# Altium project PMSM_Invertor.PrjPcb
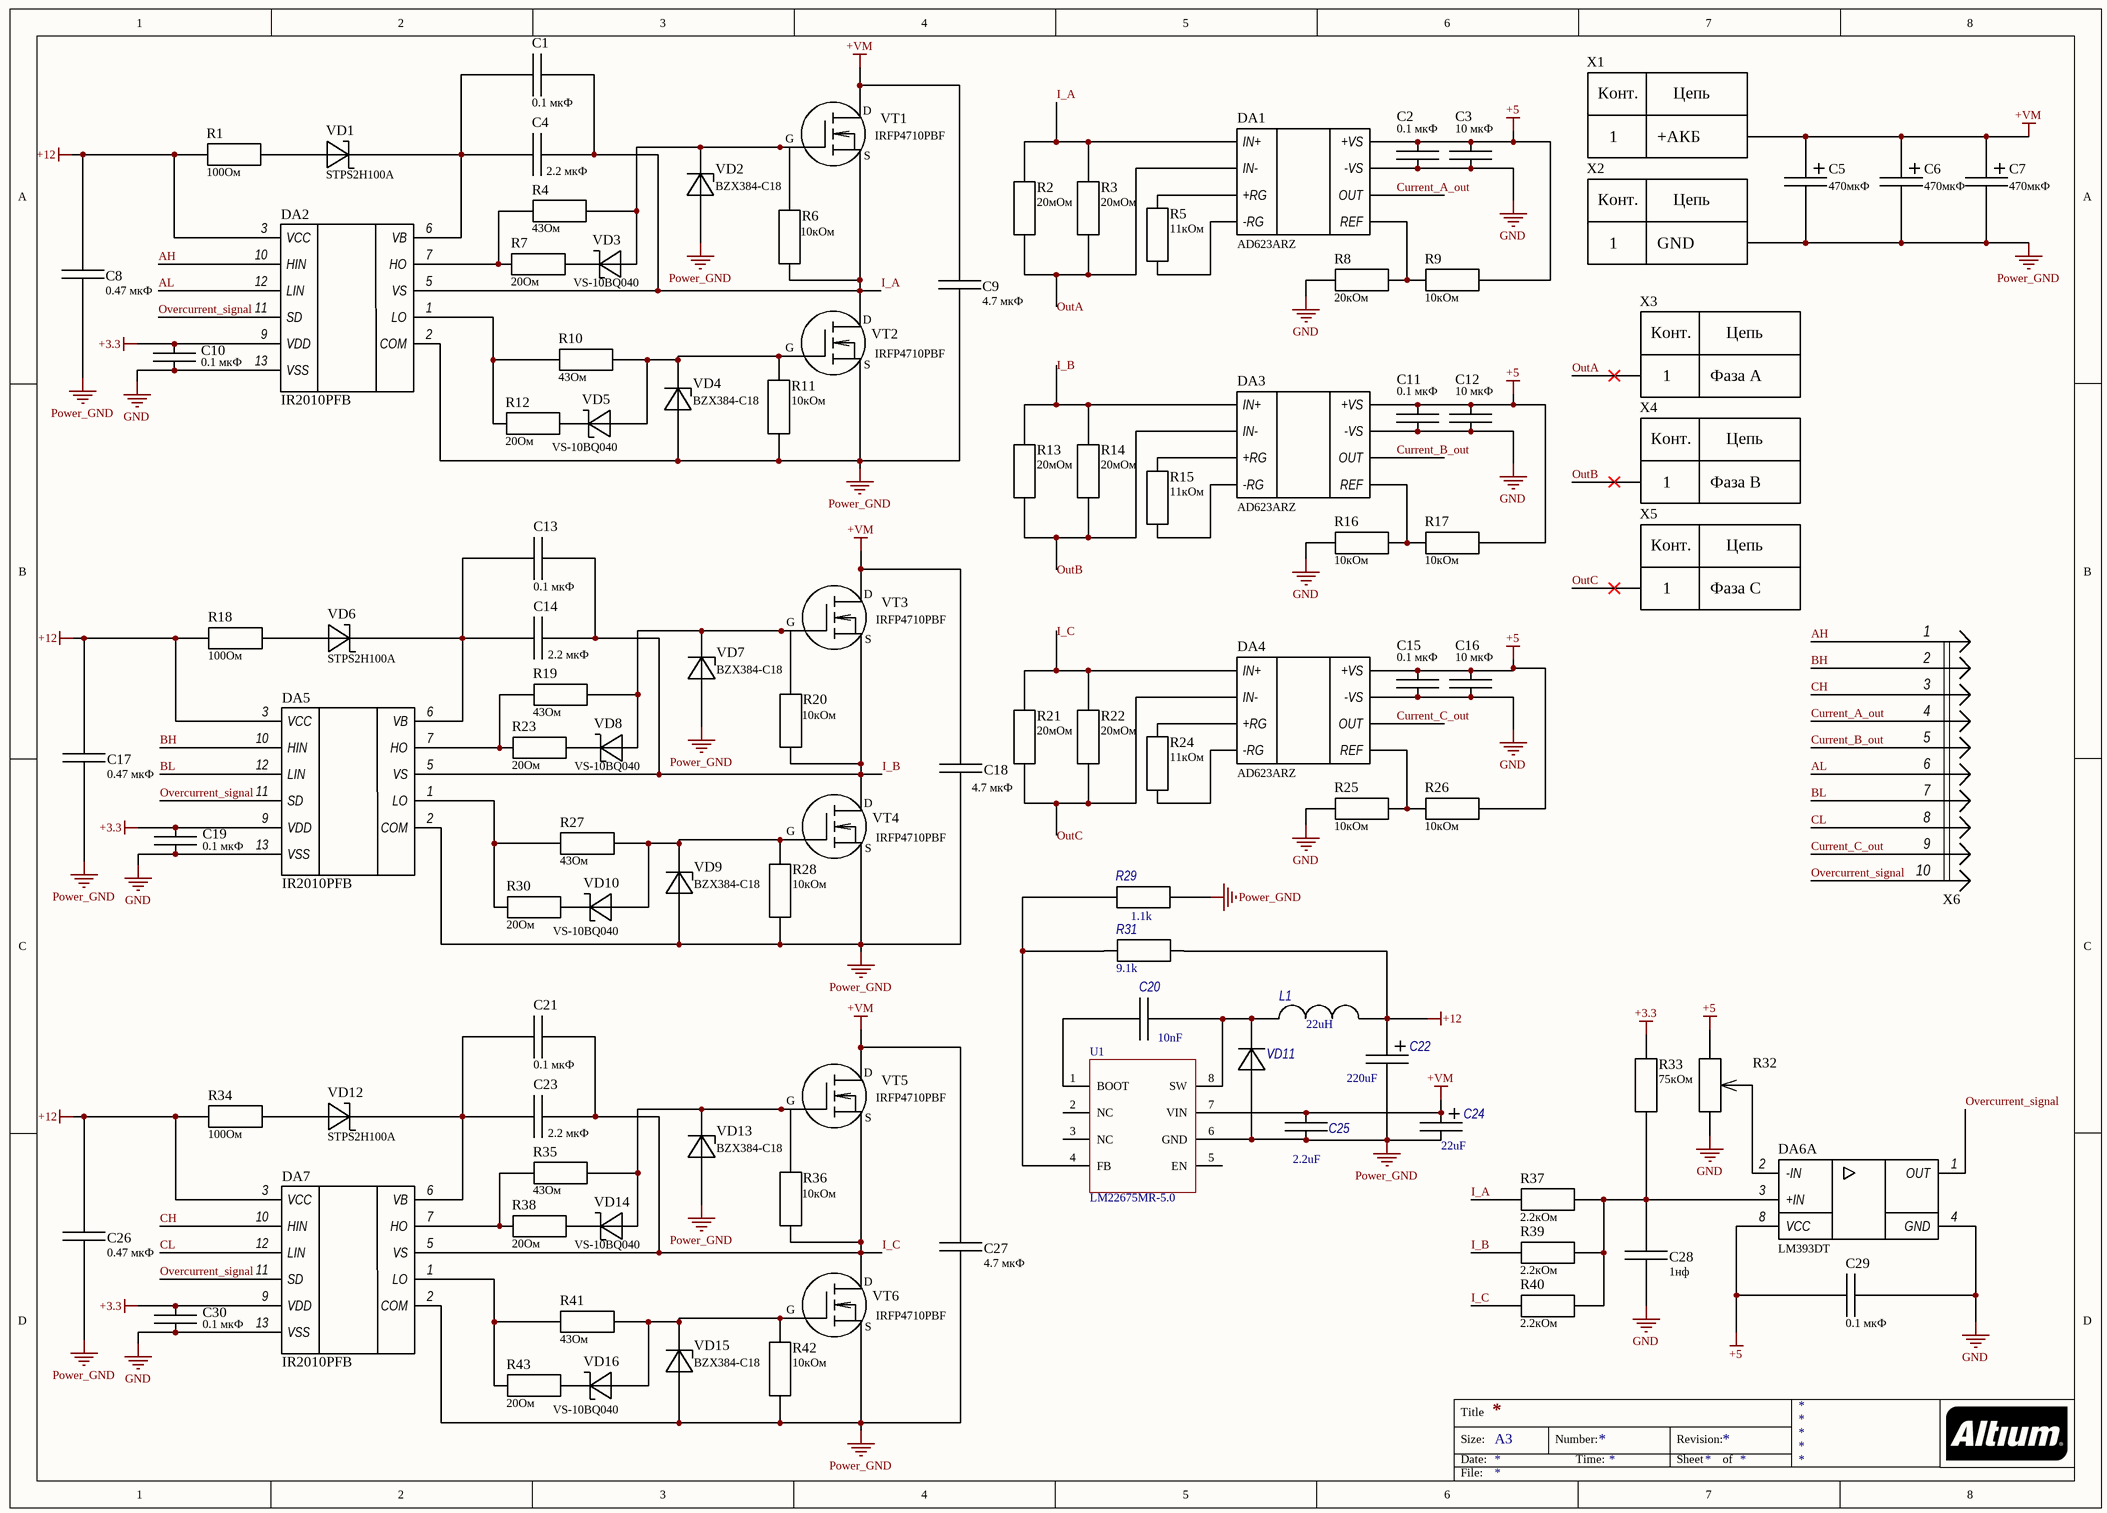
[diagram p0: bridge.SchDoc]
2 sheets, 110 parts. Net scope: global (net labels, ports and power ports of the same name join across sheets).
Board files: InvertorPCB.PcbDoc, Invertor_1.PcbDoc
Sheets:
  bridge.SchDoc
  power_elements.SchDoc

## Sheet bridge.SchDoc
size A3

### Parts
C1  value 0.1 мкФ  [0805]  (hidden comment: Capacitor)
C2  value 0.1 мкФ  [C0603C]  (hidden comment: Capacitor)
C3  value 10 мкФ  [0805]  (hidden comment: Capacitor)
C4  value 2.2 мкФ  [1812С]  (hidden comment: Capacitor)
C5  value 470мкФ  [CAP-10]  (hidden comment: Сapacitor pol)
C6  value 470мкФ  [CAP-10]  (hidden comment: Сapacitor pol)
C7  value 470мкФ  [CAP-10]  (hidden comment: Сapacitor pol)
C8  value 0.47 мкФ  [0805]  (hidden comment: Capacitor)
C9  value 4.7 мкФ  [2220С]  (hidden comment: Capacitor)
C10  value 0.1 мкФ  [C0603C]  (hidden comment: Capacitor)
C11  value 0.1 мкФ  [C0603C]  (hidden comment: Capacitor)
C12  value 10 мкФ  [0805]  (hidden comment: Capacitor)
C13  value 0.1 мкФ  [0805]  (hidden comment: Capacitor)
C14  value 2.2 мкФ  [1812С]  (hidden comment: Capacitor)
C15  value 0.1 мкФ  [C0603C]  (hidden comment: Capacitor)
C16  value 10 мкФ  [0805]  (hidden comment: Capacitor)
C17  value 0.47 мкФ  [0805]  (hidden comment: Capacitor)
C18  value 4.7 мкФ  [2220С]  (hidden comment: Capacitor)
C19  value 0.1 мкФ  [C0603C]  (hidden comment: Capacitor)
C20  value 10nF  [C0805C]
C21  value 0.1 мкФ  [0805]  (hidden comment: Capacitor)
C22  value 220uF  [CAP-8x12]
C23  value 2.2 мкФ  [1812С]  (hidden comment: Capacitor)
C24  value 22uF  [CAP-К50-35]
C25  value 2.2uF  [C1812C]
C26  value 0.47 мкФ  [0805]  (hidden comment: Capacitor)
C27  value 4.7 мкФ  [2220С]  (hidden comment: Capacitor)
C28  value 1нф  [C1206C]  (hidden comment: Capacitor)
C29  value 0.1 мкФ  [C0603C]  (hidden comment: Capacitor)
C30  value 0.1 мкФ  [C0603C]  (hidden comment: Capacitor)
DA1  AD623ARZ  [SO8]
DA2  IR2010PFB  [DIP14]
DA3  AD623ARZ  [SO8]
DA4  AD623ARZ  [SO8]
DA5  IR2010PFB  [DIP14]
DA6  LM393DT  [SO8]  (part A of 2)
DA7  IR2010PFB  [DIP14]
L1  value 22uH  [IND0488-G-E]
R1  value 100Ом  [2512R]  (hidden comment: Resistor)
R2  value 20мОм  [2816R]  (hidden comment: Resistor)
R3  value 20мОм  [2816R]  (hidden comment: Resistor)
R4  value 43Ом  [2512R]  (hidden comment: Resistor)
R5  value 11кОм  [0402R]  (hidden comment: Resistor)
R6  value 10кОм  [0402R]  (hidden comment: Resistor)
R7  value 20Ом  [2512R]  (hidden comment: Resistor)
R8  value 20кОм  [0402R]  (hidden comment: Resistor)
R9  value 10кОм  [0402R]  (hidden comment: Resistor)
R10  value 43Ом  [2512R]  (hidden comment: Resistor)
R11  value 10кОм  [0402R]  (hidden comment: Resistor)
R12  value 20Ом  [2512R]  (hidden comment: Resistor)
R13  value 20мОм  [2816R]  (hidden comment: Resistor)
R14  value 20мОм  [2816R]  (hidden comment: Resistor)
R15  value 11кОм  [0402R]  (hidden comment: Resistor)
R16  value 10кОм  [0402R]  (hidden comment: Resistor)
R17  value 10кОм  [0402R]  (hidden comment: Resistor)
R18  value 100Ом  [2512R]  (hidden comment: Resistor)
R19  value 43Ом  [2512R]  (hidden comment: Resistor)
R20  value 10кОм  [0402R]  (hidden comment: Resistor)
R21  value 20мОм  [2816R]  (hidden comment: Resistor)
R22  value 20мОм  [2816R]  (hidden comment: Resistor)
R23  value 20Ом  [2512R]  (hidden comment: Resistor)
R24  value 11кОм  [0402R]  (hidden comment: Resistor)
R25  value 10кОм  [0402R]  (hidden comment: Resistor)
R26  value 10кОм  [0402R]  (hidden comment: Resistor)
R27  value 43Ом  [2512R]  (hidden comment: Resistor)
R28  value 10кОм  [0402R]  (hidden comment: Resistor)
R29  value 1.1k  [C0805R]
R30  value 20Ом  [2512R]  (hidden comment: Resistor)
R31  value 9.1k  [C0805R]
R32  pot  [3296W]  (value not drawn)
R33  value 75кОм  [0402R]  (hidden comment: Resistor)
R34  value 100Ом  [2512R]  (hidden comment: Resistor)
R35  value 43Ом  [2512R]  (hidden comment: Resistor)
R36  value 10кОм  [0402R]  (hidden comment: Resistor)
R37  value 2.2кОм  [0402R]  (hidden comment: Resistor)
R38  value 20Ом  [2512R]  (hidden comment: Resistor)
R39  value 2.2кОм  [0402R]  (hidden comment: Resistor)
R40  value 2.2кОм  [0402R]  (hidden comment: Resistor)
R41  value 43Ом  [2512R]  (hidden comment: Resistor)
R42  value 10кОм  [0402R]  (hidden comment: Resistor)
R43  value 20Ом  [2512R]  (hidden comment: Resistor)
U1  LM22675MR-5.0  [LM22675MR-5.0/NOPB]
VD1  STPS2H100A  [D0-124AC]
VD2  BZX384-C18  [SOD323]
VD3  VS-10BQ040  [D0-124AC]
VD4  BZX384-C18  [SOD323]
VD5  VS-10BQ040  [D0-124AC]
VD6  STPS2H100A  [D0-124AC]
VD7  BZX384-C18  [SOD323]
VD8  VS-10BQ040  [D0-124AC]
VD9  BZX384-C18  [SOD323]
VD10  VS-10BQ040  [D0-124AC]
VD11  (no value)  [DO-214AA]
VD12  STPS2H100A  [D0-124AC]
VD13  BZX384-C18  [SOD323]
VD14  VS-10BQ040  [D0-124AC]
VD15  BZX384-C18  [SOD323]
VD16  VS-10BQ040  [D0-124AC]
VT1  IRFP4710PBF  [TO247-2]
VT2  IRFP4710PBF  [TO247-1]
VT3  IRFP4710PBF  [TO247-2]
VT4  IRFP4710PBF  [TO247-1]
VT5  IRFP4710PBF  [TO247-2]
VT6  IRFP4710PBF  [TO247-1]
X1  Name: +АКБ  [PCBM4]  (hidden comment: Connector-1)
X2  Name: GND  [PCBM4]  (hidden comment: Connector-1)
X3  Name: Фаза А  [PCBM4]  (hidden comment: Connector-1_1)
X4  Name: Фаза B  [PCBM4]  (hidden comment: Connector-1_1)
X5  Name: Фаза C  [PCBM4]  (hidden comment: Connector-1_1)
X6  PLS-2x5  [PLS-2x5]  (value not drawn)

### Nets
+3.3: C10.2 C19.2 C30.2 DA2.9(VDD) DA5.9(VDD) DA7.9(VDD) R33.2
+5: C2.2 C3.2 C11.2 C12.2 C15.2 C16.2 C29.1 DA1.7(+VS) DA3.7(+VS) DA4.7(+VS) DA6.8(VCC) R9.2 R17.2 R26.2 R32.1
+12: C8.2 C17.2 C22.1 C26.2 DA2.3(VCC) DA5.3(VCC) DA7.3(VCC) L1.2 R1.2 R18.2 R31.2 R34.2
+VM: C5.1 C6.1 C7.1 C9.2 C18.2 C24.1 C25.1 C27.2 U1.7(VIN) VT1.D VT3.D VT5.D X1.1
GND: C2.1 C3.1 C10.1 C11.1 C12.1 C15.1 C16.1 C19.1 C28.1 C29.2 C30.1 DA1.4(-VS) DA2.13(VSS) DA3.4(-VS) DA4.4(-VS) DA5.13(VSS) DA6.4(GND) DA7.13(VSS) R8.1 R16.1 R25.1 R32.3
Power_GND: C5.2 C6.2 C7.2 C8.1 C9.1 C17.1 C18.1 C22.2 C24.2 C25.2 C26.1 C27.1 DA2.2(COM) DA5.2(COM) DA7.2(COM) R11.2 R28.2 R29.1 R42.2 U1.6(GND) VD2.A VD4.A VD7.A VD9.A VD11.A VD13.A VD15.A VT2.S VT4.S VT6.S X2.1
AH: DA2.10(HIN) X6.1
AL: DA2.12(LIN) X6.6
BH: DA5.10(HIN) X6.2
BL: DA5.12(LIN) X6.7
CH: DA7.10(HIN) X6.3
CL: DA7.12(LIN) X6.8
Current_A_out: DA1.6(OUT) X6.4
Current_B_out: DA3.6(OUT) X6.5
Current_C_out: DA4.6(OUT) X6.9
I_A: C1.1 C4.2 DA1.3(IN+) DA2.5(VS) R2.1 R3.1 R6.2 R37.1 VT1.S VT2.D
I_B: C13.1 C14.2 DA3.3(IN+) DA5.5(VS) R13.1 R14.1 R20.2 R39.1 VT3.S VT4.D
I_C: C21.1 C23.2 DA4.3(IN+) DA7.5(VS) R21.1 R22.1 R36.2 R40.1 VT5.S VT6.D
OutA: DA1.2(IN-) R2.2 R3.2 X3.1
OutB: DA3.2(IN-) R13.2 R14.2 X4.1
OutC: DA4.2(IN-) R21.2 R22.2 X5.1
Overcurrent_signal: DA2.11(SD) DA5.11(SD) DA6.1(OUT) DA7.11(SD) X6.10
NetC1_2: C1.2 C4.1 DA2.6(VB) VD1.C
NetC13_2: C13.2 C14.1 DA5.6(VB) VD6.C
NetC20_1: C20.1 U1.1(BOOT)
NetC20_2: C20.2 L1.1 U1.8(SW) VD11.C
NetC21_2: C21.2 C23.1 DA7.6(VB) VD12.C
NetC28_2: C28.2 DA6.3(+IN) R33.1 R37.2 R39.2 R40.2
NetDA1_1: DA1.1(-RG) R5.2
NetDA1_5: DA1.5(REF) R8.2 R9.1
NetDA1_8: DA1.8(+RG) R5.1
NetDA2_1: DA2.1(LO) R10.2 R12.2
NetDA2_7: DA2.7(HO) R4.2 R7.2
NetDA3_1: DA3.1(-RG) R15.2
NetDA3_5: DA3.5(REF) R16.2 R17.1
NetDA3_8: DA3.8(+RG) R15.1
NetDA4_1: DA4.1(-RG) R24.2
NetDA4_5: DA4.5(REF) R25.2 R26.1
NetDA4_8: DA4.8(+RG) R24.1
NetDA5_1: DA5.1(LO) R27.2 R30.2
NetDA5_7: DA5.7(HO) R19.2 R23.2
NetDA6_2: DA6.2(-IN) R32.2
NetDA7_1: DA7.1(LO) R41.2 R43.2
NetDA7_7: DA7.7(HO) R35.2 R38.2
NetR1_1: R1.1 VD1.A
NetR4_1: R4.1 R6.1 VD2.C VD3.A VT1.G
NetR7_1: R7.1 VD3.C
NetR10_1: R10.1 R11.1 VD4.C VD5.A VT2.G
NetR12_1: R12.1 VD5.C
NetR18_1: R18.1 VD6.A
NetR19_1: R19.1 R20.1 VD7.C VD8.A VT3.G
NetR23_1: R23.1 VD8.C
NetR27_1: R27.1 R28.1 VD9.C VD10.A VT4.G
NetR29_2: R29.2 R31.1 U1.4(FB)
NetR30_1: R30.1 VD10.C
NetR34_1: R34.1 VD12.A
NetR35_1: R35.1 R36.1 VD13.C VD14.A VT5.G
NetR38_1: R38.1 VD14.C
NetR41_1: R41.1 R42.1 VD15.C VD16.A VT6.G
NetR43_1: R43.1 VD16.C

Not connected (* = marked no-connect by the designer): U1 2(NC) 3(NC) 5(EN)

### Notes on the sheet
- Title
- Size:
- Date:
- A3
- Number:
- Time:
- Revision:
- Sheet
- of
- File:
- (in symbol Connector-1) Конт.; Цепь
- (in symbol Connector-1_1) Конт.; Цепь

### Library data of the parts
C20 C25 = Cap: ComponentLink1Description: New link
  C20: ComponentLink1URL: https://www.chipdip.ru/product/grm216r71h103k
  C25: ComponentLink1URL: https://www.chipdip.ru/product0/9000144596
C22 C24 = CapPol: ComponentLink1Description: New link
  C22: ComponentLink1URL: https://www.chipdip.ru/product0/9000565758
  C24: ComponentLink1URL: https://www.chipdip.ru/product0/9000565851
DA1 DA3 DA4 = AD623ARZ-R7: ComponentLink1Description: Product link; ComponentLink1URL: https://www.platan.ru/cgi-bin/qwery.pl/id=2010029983; Datasheet: https://doc.platan.ru/pdf/datasheets/analogdevices/AD623-877194.pdf
  DA1: ComponentLink2Description: Droduct link 2; ComponentLink2URL: https://www.platan.ru/cgi-bin/qwery.pl/id=2011915272
DA2 DA5 DA7 = IR2010SPFB: ComponentLink1Description: Product link; ComponentLink1URL: https://www.chipdip.ru/product/ir2010
DA6 = Comparator: ComponentLink1Description: Product link; ComponentLink1URL: https://www.chipdip.ru/product/lm393d-stm
L1 = Inductor: ComponentLink1Description: New link; ComponentLink1URL: https://www.chipdip.ru/product/b82472g6223m000-22
R1 R4 R7 R10 R12 R18 R19 R23 R27 R30 R34 R35 R38 R41 R43 = Resistor: Power: 1Вт; ComponentLink1Description: Product link
  R1 R18 R34: ComponentLink1URL: https://www.chipdip.ru/product0/9000189977
  R4 R10 R19 R27 R35 R41: ComponentLink1URL: https://www.chipdip.ru/product0/9000190080
  R7 R12 R23 R30 R38 R43: ComponentLink1URL: https://www.chipdip.ru/product0/9000190063
R2 R3 R13 R14 R21 R22 = Resistor: Power: 2В; ComponentLink1Description: Product link; ComponentLink1URL: https://www.platan.ru/cgi-bin/qwery.pl/id=224066896
R6 R8 R9 R11 R16 R17 R20 R25 R26 R28 R33 R36 R37 R39 R40 R42 = Resistor: Power: 0.062; ComponentLink1Description: Product link
  R6 R8 R9 R11 R16 R17 R20 R25 R26 R28 R36 R42: ComponentLink1URL: https://www.chipdip.ru/product0/9000189664
  R33: ComponentLink1URL: https://www.chipdip.ru/product0/9000189752
  R37 R39 R40: ComponentLink1URL: https://www.chipdip.ru/product0/9000189810
R29 R31 = res: ComponentLink1Description: New link
  R29: ComponentLink1URL: https://www.chipdip.ru/product0/9000079487
  R31: ComponentLink1URL: https://www.chipdip.ru/product0/9000079513
U1 = LM22675MR-5.0/NOPB: ComponentLink1Description: New link; ComponentLink1URL: https://www.chipdip.ru/product/lm22675mr-5.0-nopb-2
VD1 VD6 VD12 = Bootstrap diode: ComponentLink1Description: Product link; ComponentLink1URL: https://www.chipdip.ru/product/stps2h100a-2
VD2 VD4 VD7 VD9 VD13 VD15 = Zener diode: ComponentLink1Description: Product link; ComponentLink1URL: https://www.chipdip.ru/product/bzx384-c18.115
VD3 VD5 VD8 VD10 VD14 VD16 = Shotki: ComponentLink1Description: Product link; ComponentLink1URL: https://www.chipdip.ru/product/10bq040
VD11 = DIODE: ComponentLink1Description: New link; ComponentLink1URL: https://www.chipdip.ru/product/sk16-diotec
VT1-VT6 = N-MOSFET: ComponentLink1Description: Product link; ComponentLink1URL: https://www.chipdip.ru/product/irfp4710pbf
C1-C4 C8-C19 C21 C23 C26-C30 = Capacitor: ComponentLink1Description: Product link
  C1 C13 C21: ComponentLink1URL: https://www.chipdip.ru/product/grm219f51h104z
  C2 C10 C11 C15 C19 C29 C30: ComponentLink1URL: https://www.chipdip.ru/product0/9000591947
  C3 C12 C16: ComponentLink1URL: https://www.chipdip.ru/product0/9000671061
  C4 C14 C23: ComponentLink1URL: https://www.chipdip.ru/product0/9000144596
  C8 C17 C26: ComponentLink1URL: https://www.chipdip.ru/product/grm21bf51e474z
  C9 C18 C27: ComponentLink1URL: https://www.chipdip.ru/product0/8001641628
  C28: ComponentLink1URL: https://www.chipdip.ru/product/grm319r71h102k
C5-C7 = Сapacitor pol: ComponentLink1Description: Product link; ComponentLink1URL: https://www.chipdip.ru/product0/9000565913; Type: *
R5 R15 R24 = Resistor: ComponentLink1Description: Product link; ComponentLink1URL: https://www.chipdip.ru/product0/9000189841; Power: *
R32 = pot: ComponentLink1Description: Product link; ComponentLink1URL: https://www.chipdip.ru/product/3296w-1-103
X1 X2 = Connector-1: ComponentLink1Description: Product link
X3-X5 = Connector-1_1: ComponentLink1Description: Product link
X6 = PLS-2x5: ComponentLink1Description: Product link

## Sheet power_elements.SchDoc
size A3

### Notes on the sheet
- Title
- Size:
- Date:
- A3
- Number:
- Time:
- Revision:
- Sheet
- of
- File: